# Altium schematic sheet ADS8686S_BLOCK_A.SchDoc
size A3; SheetNumber: 12; SheetTotal: 14
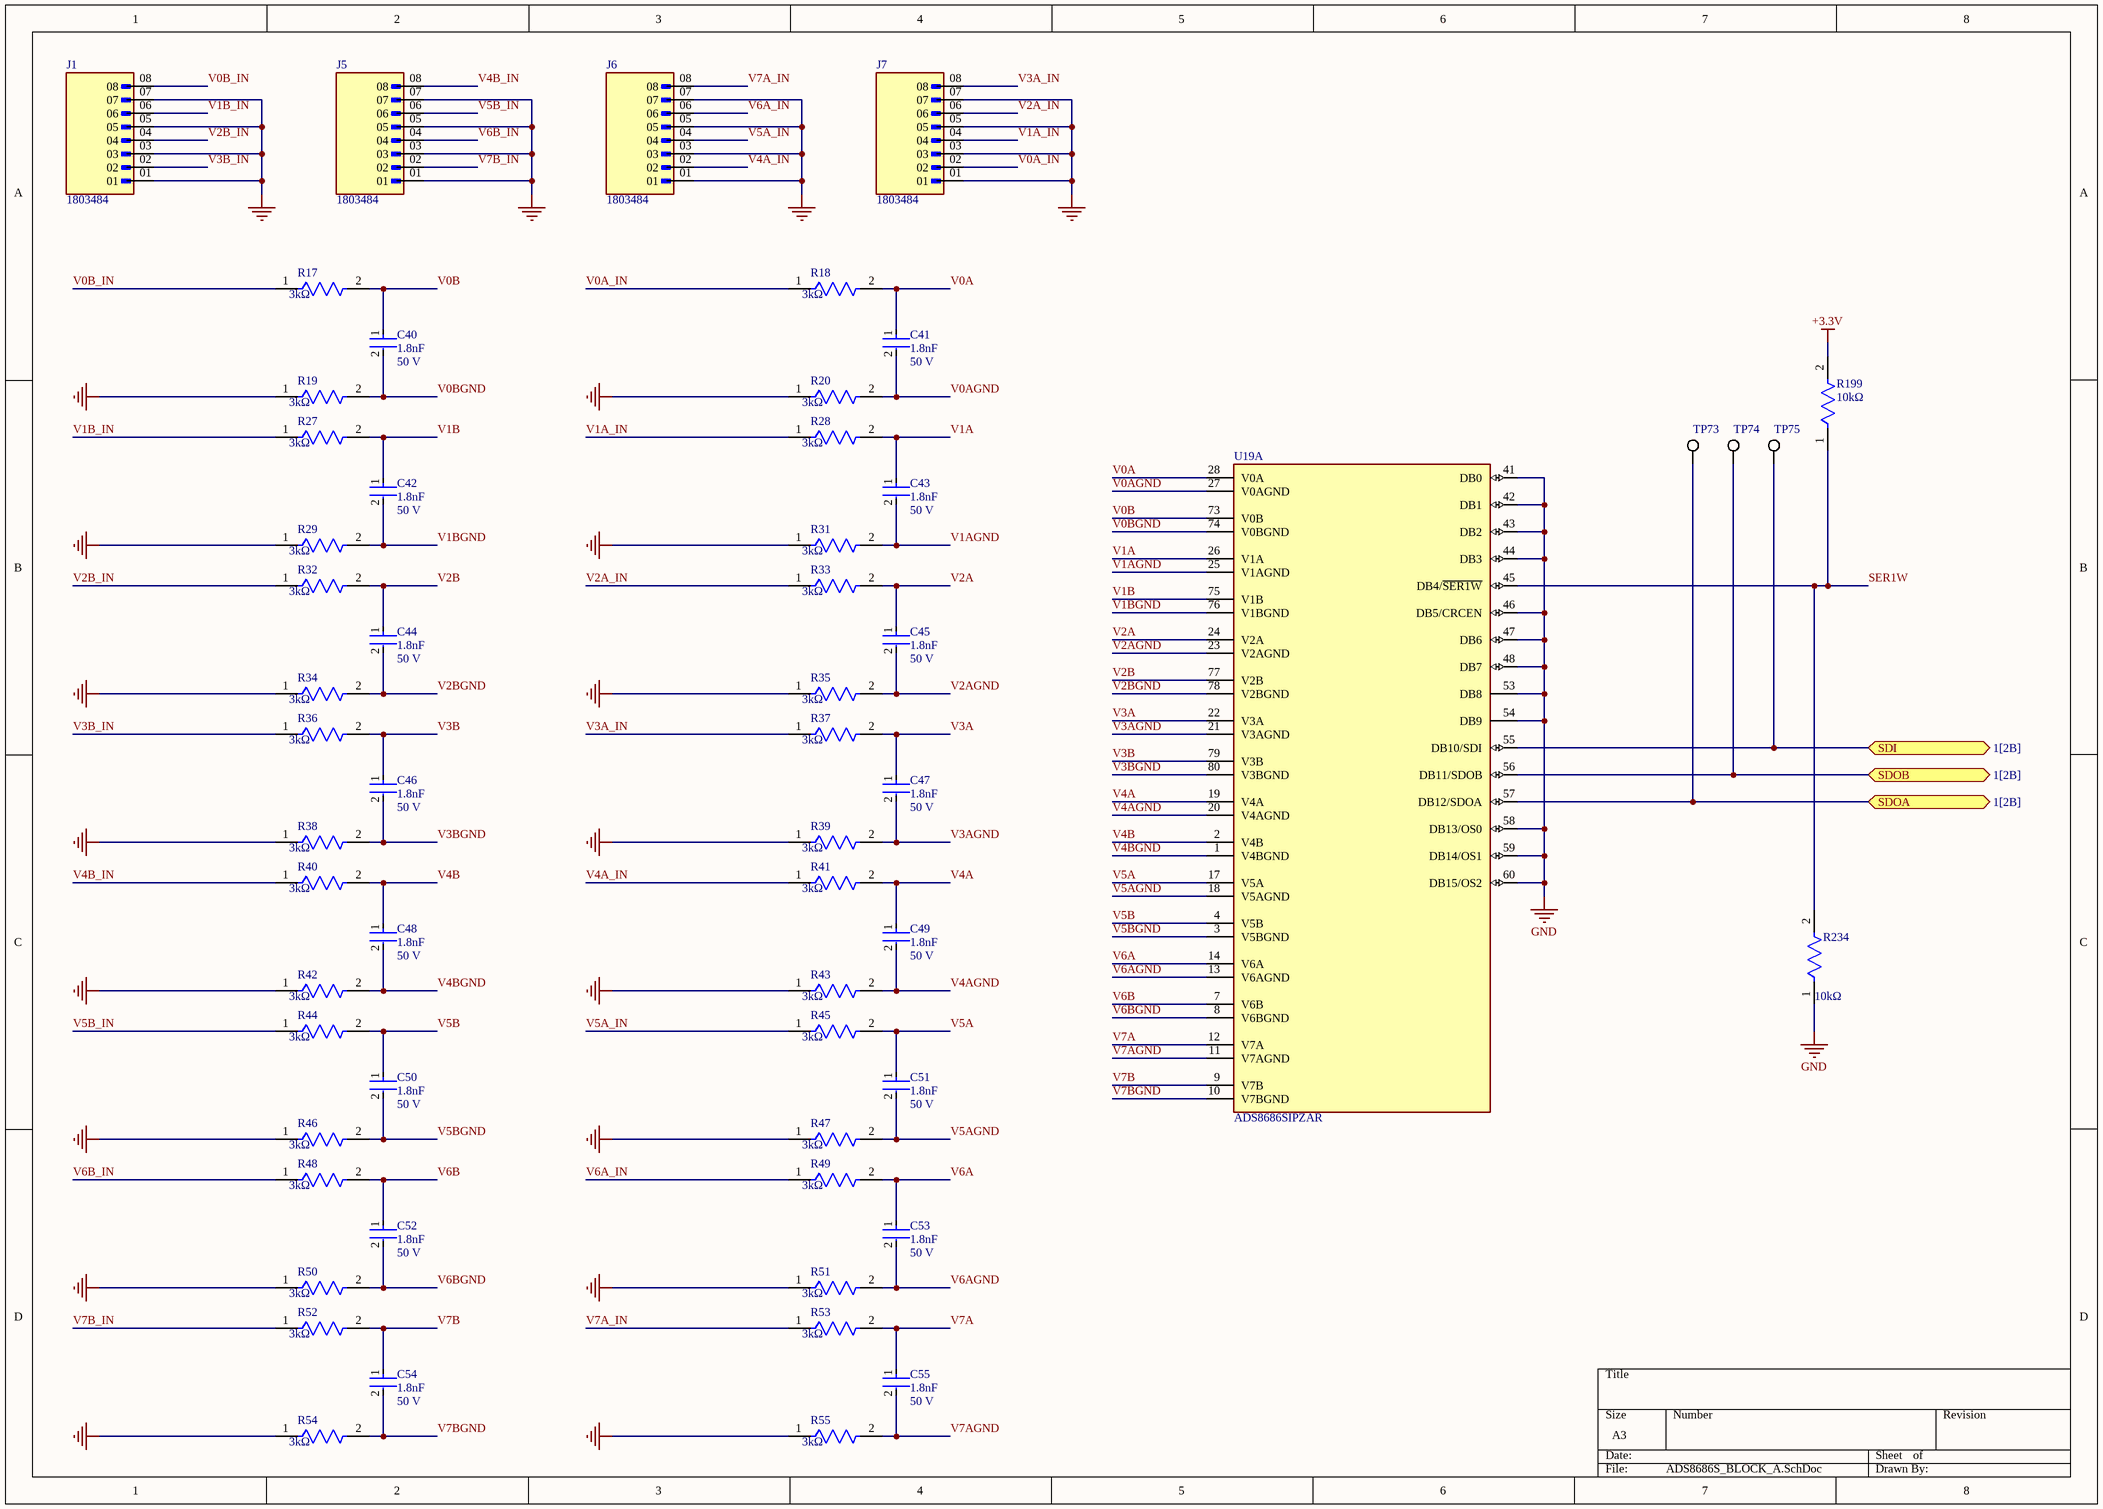
[diagram p0: ADS8686S_BLOCK_A.SchDoc]

## Parts
C40  Capacitance: 1.8nF  Voltage Rating: 50 V  [FP-C0603C-CF-IPC_B]  (hidden comment: C0603C182J5GACTU)
C41  Capacitance: 1.8nF  Voltage Rating: 50 V  [FP-C0603C-CF-IPC_B]  (hidden comment: C0603C182J5GACTU)
C42  Capacitance: 1.8nF  Voltage Rating: 50 V  [FP-C0603C-CF-IPC_B]  (hidden comment: C0603C182J5GACTU)
C43  Capacitance: 1.8nF  Voltage Rating: 50 V  [FP-C0603C-CF-IPC_B]  (hidden comment: C0603C182J5GACTU)
C44  Capacitance: 1.8nF  Voltage Rating: 50 V  [FP-C0603C-CF-IPC_B]  (hidden comment: C0603C182J5GACTU)
C45  Capacitance: 1.8nF  Voltage Rating: 50 V  [FP-C0603C-CF-IPC_B]  (hidden comment: C0603C182J5GACTU)
C46  Capacitance: 1.8nF  Voltage Rating: 50 V  [FP-C0603C-CF-IPC_B]  (hidden comment: C0603C182J5GACTU)
C47  Capacitance: 1.8nF  Voltage Rating: 50 V  [FP-C0603C-CF-IPC_B]  (hidden comment: C0603C182J5GACTU)
C48  Capacitance: 1.8nF  Voltage Rating: 50 V  [FP-C0603C-CF-IPC_B]  (hidden comment: C0603C182J5GACTU)
C49  Capacitance: 1.8nF  Voltage Rating: 50 V  [FP-C0603C-CF-IPC_B]  (hidden comment: C0603C182J5GACTU)
C50  Capacitance: 1.8nF  Voltage Rating: 50 V  [FP-C0603C-CF-IPC_B]  (hidden comment: C0603C182J5GACTU)
C51  Capacitance: 1.8nF  Voltage Rating: 50 V  [FP-C0603C-CF-IPC_B]  (hidden comment: C0603C182J5GACTU)
C52  Capacitance: 1.8nF  Voltage Rating: 50 V  [FP-C0603C-CF-IPC_B]  (hidden comment: C0603C182J5GACTU)
C53  Capacitance: 1.8nF  Voltage Rating: 50 V  [FP-C0603C-CF-IPC_B]  (hidden comment: C0603C182J5GACTU)
C54  Capacitance: 1.8nF  Voltage Rating: 50 V  [FP-C0603C-CF-IPC_B]  (hidden comment: C0603C182J5GACTU)
C55  Capacitance: 1.8nF  Voltage Rating: 50 V  [FP-C0603C-CF-IPC_B]  (hidden comment: C0603C182J5GACTU)
J1  1803484  [PHOENIX_1803484]
J5  1803484  [PHOENIX_1803484]
J6  1803484  [PHOENIX_1803484]
J7  1803484  [PHOENIX_1803484]
R17  Resistance: 3kΩ  [FP-AC0603-IPC_B]  (hidden comment: AC0603FR-073KL)
R18  Resistance: 3kΩ  [FP-AC0603-IPC_B]  (hidden comment: AC0603FR-073KL)
R19  Resistance: 3kΩ  [FP-AC0603-IPC_B]  (hidden comment: AC0603FR-073KL)
R20  Resistance: 3kΩ  [FP-AC0603-IPC_B]  (hidden comment: AC0603FR-073KL)
R27  Resistance: 3kΩ  [FP-AC0603-IPC_B]  (hidden comment: AC0603FR-073KL)
R28  Resistance: 3kΩ  [FP-AC0603-IPC_B]  (hidden comment: AC0603FR-073KL)
R29  Resistance: 3kΩ  [FP-AC0603-IPC_B]  (hidden comment: AC0603FR-073KL)
R31  Resistance: 3kΩ  [FP-AC0603-IPC_B]  (hidden comment: AC0603FR-073KL)
R32  Resistance: 3kΩ  [FP-AC0603-IPC_B]  (hidden comment: AC0603FR-073KL)
R33  Resistance: 3kΩ  [FP-AC0603-IPC_B]  (hidden comment: AC0603FR-073KL)
R34  Resistance: 3kΩ  [FP-AC0603-IPC_B]  (hidden comment: AC0603FR-073KL)
R35  Resistance: 3kΩ  [FP-AC0603-IPC_B]  (hidden comment: AC0603FR-073KL)
R36  Resistance: 3kΩ  [FP-AC0603-IPC_B]  (hidden comment: AC0603FR-073KL)
R37  Resistance: 3kΩ  [FP-AC0603-IPC_B]  (hidden comment: AC0603FR-073KL)
R38  Resistance: 3kΩ  [FP-AC0603-IPC_B]  (hidden comment: AC0603FR-073KL)
R39  Resistance: 3kΩ  [FP-AC0603-IPC_B]  (hidden comment: AC0603FR-073KL)
R40  Resistance: 3kΩ  [FP-AC0603-IPC_B]  (hidden comment: AC0603FR-073KL)
R41  Resistance: 3kΩ  [FP-AC0603-IPC_B]  (hidden comment: AC0603FR-073KL)
R42  Resistance: 3kΩ  [FP-AC0603-IPC_B]  (hidden comment: AC0603FR-073KL)
R43  Resistance: 3kΩ  [FP-AC0603-IPC_B]  (hidden comment: AC0603FR-073KL)
R44  Resistance: 3kΩ  [FP-AC0603-IPC_B]  (hidden comment: AC0603FR-073KL)
R45  Resistance: 3kΩ  [FP-AC0603-IPC_B]  (hidden comment: AC0603FR-073KL)
R46  Resistance: 3kΩ  [FP-AC0603-IPC_B]  (hidden comment: AC0603FR-073KL)
R47  Resistance: 3kΩ  [FP-AC0603-IPC_B]  (hidden comment: AC0603FR-073KL)
R48  Resistance: 3kΩ  [FP-AC0603-IPC_B]  (hidden comment: AC0603FR-073KL)
R49  Resistance: 3kΩ  [FP-AC0603-IPC_B]  (hidden comment: AC0603FR-073KL)
R50  Resistance: 3kΩ  [FP-AC0603-IPC_B]  (hidden comment: AC0603FR-073KL)
R51  Resistance: 3kΩ  [FP-AC0603-IPC_B]  (hidden comment: AC0603FR-073KL)
R52  Resistance: 3kΩ  [FP-AC0603-IPC_B]  (hidden comment: AC0603FR-073KL)
R53  Resistance: 3kΩ  [FP-AC0603-IPC_B]  (hidden comment: AC0603FR-073KL)
R54  Resistance: 3kΩ  [FP-AC0603-IPC_B]  (hidden comment: AC0603FR-073KL)
R55  Resistance: 3kΩ  [FP-AC0603-IPC_B]  (hidden comment: AC0603FR-073KL)
R199  Resistance: 10kΩ  [FP-RC0603-0_55-IPC_B]  (hidden comment: RC0603FR-0710KL)
R234  Resistance: 10kΩ  [FP-RC0603-0_55-IPC_B]  (hidden comment: RC0603FR-0710KL)
TP73  5019  [KSTN-5019_V]  (value not drawn)
TP74  5019  [KSTN-5019_V]  (value not drawn)
TP75  5019  [KSTN-5019_V]  (value not drawn)
U19  ADS8686SIPZAR  [TI-RECOMMENDED]  (part A of 2)

## Ports
SDI (bidir, see 1[2B]), SDOA (bidir, see 1[2B]), SDOB (bidir, see 1[2B])

## Nets
+3.3V: R199.2
GND: J1.01 J1.03 J1.05 J1.07 J5.01 J5.03 J5.05 J5.07 J6.01 J6.03 J6.05 J6.07 J7.01 J7.03 J7.05 J7.07 R19.1 R20.1 R29.1 R31.1 R34.1 R35.1 R38.1 R39.1 R42.1 R43.1 R46.1 R47.1 R50.1 R51.1 R54.1 R55.1 R234.1 U19.41(DB0) U19.42(DB1) U19.43(DB2) U19.44(DB3) U19.46(DB5/CRCEN) U19.47(DB6) U19.48(DB7) U19.53(DB8) U19.54(DB9) U19.58(DB13/OS0) U19.59(DB14/OS1) U19.60(DB15/OS2)
SDI: TP75.1 U19.55(DB10/SDI) ; port SDI
SDOA: TP73.1 U19.57(DB12/SDOA) ; port SDOA
SDOB: TP74.1 U19.56(DB11/SDOB) ; port SDOB
SER1W: R199.1 R234.2 U19.45(DB4/~{SER1W})
V0A: C41.1 R18.2 U19.28(V0A)
V0A_IN: J7.02 R18.1
V0AGND: C41.2 R20.2 U19.27(V0AGND)
V0B: C40.1 R17.2 U19.73(V0B)
V0B_IN: J1.08 R17.1
V0BGND: C40.2 R19.2 U19.74(V0BGND)
V1A: C43.1 R28.2 U19.26(V1A)
V1A_IN: J7.04 R28.1
V1AGND: C43.2 R31.2 U19.25(V1AGND)
V1B: C42.1 R27.2 U19.75(V1B)
V1B_IN: J1.06 R27.1
V1BGND: C42.2 R29.2 U19.76(V1BGND)
V2A: C45.1 R33.2 U19.24(V2A)
V2A_IN: J7.06 R33.1
V2AGND: C45.2 R35.2 U19.23(V2AGND)
V2B: C44.1 R32.2 U19.77(V2B)
V2B_IN: J1.04 R32.1
V2BGND: C44.2 R34.2 U19.78(V2BGND)
V3A: C47.1 R37.2 U19.22(V3A)
V3A_IN: J7.08 R37.1
V3AGND: C47.2 R39.2 U19.21(V3AGND)
V3B: C46.1 R36.2 U19.79(V3B)
V3B_IN: J1.02 R36.1
V3BGND: C46.2 R38.2 U19.80(V3BGND)
V4A: C49.1 R41.2 U19.19(V4A)
V4A_IN: J6.02 R41.1
V4AGND: C49.2 R43.2 U19.20(V4AGND)
V4B: C48.1 R40.2 U19.2(V4B)
V4B_IN: J5.08 R40.1
V4BGND: C48.2 R42.2 U19.1(V4BGND)
V5A: C51.1 R45.2 U19.17(V5A)
V5A_IN: J6.04 R45.1
V5AGND: C51.2 R47.2 U19.18(V5AGND)
V5B: C50.1 R44.2 U19.4(V5B)
V5B_IN: J5.06 R44.1
V5BGND: C50.2 R46.2 U19.3(V5BGND)
V6A: C53.1 R49.2 U19.14(V6A)
V6A_IN: J6.06 R49.1
V6AGND: C53.2 R51.2 U19.13(V6AGND)
V6B: C52.1 R48.2 U19.7(V6B)
V6B_IN: J5.04 R48.1
V6BGND: C52.2 R50.2 U19.8(V6BGND)
V7A: C55.1 R53.2 U19.12(V7A)
V7A_IN: J6.08 R53.1
V7AGND: C55.2 R55.2 U19.11(V7AGND)
V7B: C54.1 R52.2 U19.9(V7B)
V7B_IN: J5.02 R52.1
V7BGND: C54.2 R54.2 U19.10(V7BGND)

## Library data of the parts
C40-C55 = CMP-2006-03369-2: CAP CER 1800PF 50V NP0 0603; Manufacturer: KEMET; Value: 1,800 pF; Temperature Characteristic: C0G; Tolerance: 0.05; Material: Ceramic; Automotive Grade: Grade 1; Temperature Coefficient: 30ppm/°C; Package: C0603C-CF; Temperature Range High: +125°C; Temperature Range Low: -55°C; Category: Cap; Automotive: Yes; Manufacturer Part Number: C0603C182J5GACTU; RoHS: TRUE; Device Class L2: Capacitors; Device Class L3: Ceramic Capacitors; Octopart: https://octopart.com/c0603c182j5gactu-kemet-13174208; Lead Free: Yes; Temperature: -55°C to +125°C; Height: 0.87mm; Mouser Description: Multilayer Ceramic Capacitors MLCC - SMD/SMT 50volts 1800pF 5% C0G; Digikey Description: CAP CER 1800PF 50V NP0 0603; Device Class L1: Passive Components; ComponentLink2URL: https://api.kemet.com/component-edge/download/datasheet/C0603C100J5GACAUTO.pdf; ComponentLink2Description: Datasheet
J1 J5-J7 = 1803484: MF: {'manufacturer': u'Phoenix Contact'}; Package: None; Price: None; Value: *; MP: 1803484; Availability: Unavailable
R17-R20 R27-R29 R31-R55 = CMP-2000-04842-2: RES 3kΩ 1.00% 0.1W 0603; Max Power Dissipation: 100mW; Temperature Coefficient: 100ppm/°C; Tolerance: 1%; Voltage Rating: 50V; Series: AC; Lead Free: Lead Free; Height: 0.45mm; Case Code (Metric): 1608; Case Code (Imperial): 0603; Case/Package: 0603; Length: 1.6mm; RoHS Compliant: Yes; Width: 0.8mm; Ratings: AEC-Q200; Packaging: Tape and Reel; Termination: SMD/SMT; Max Operating Temperature: 155°C; Resistor Type: Thick Film; Power Rating: 100mW; Min Operating Temperature: -55°C; Number of Terminations: 2; Features: Moisture Resistant
R199 R234 = CMP-2100-03664-2: RES 10K OHM 1% 1/10W 0603; Voltage Rating: 75V; Voltage Rating (DC): 50V; Power Rating: 100mW; Temperature Coefficient: 100ppm/°C; Depth: 0.8mm; Termination: SMD/SMT; Resistor Type: Thick Film; Series: RC; Construction: Rectangular; Features: Moisture Resistant; Packaging: Tape and Reel; Min Operating Temperature: -55°C; Number of Terminations: 2; Lead Pitch: 0.3mm; RoHS Compliant: Yes; Case/Package: 0603; Resistance Tolerance: 1%; Military Standard: Not; Weight: 7.1E-05oz; Number of Pins: 2; Tolerance: 1%; Length: 1.6mm; Case Code (Imperial): 0603; Lead Free: Lead Free; Width: 0.8mm; Max Power Dissipation: 100mW; Height: 0.45mm; Max Operating Temperature: 155°C; Case Code (Metric): 1608; Size Code: 0603
TP73-TP75 = CMP-1672-00008-1: Test Point, 1 Position SMD, RoHS, Tape and Reel; ComponentLink1Description: Manufacturer URL; Package Quantity: 1000; DatasheetVersion: 03/2014; Packaging: Tape and Reel; ComponentLink2URL: http://www.keyelco.com/product-pdf.cfm?p=1357; ComponentLink1URL: http://www.keyelco.com/; Mount: Surface Mount; Contact Plating: Silver; PackageDescription: 1-Pin Surface Mount Device, Body 3.81 x 2.03 mm; Pins: 1; RoHSCompliant: True; Mounting Technology: Surface Mount; ComponentLink2Description: Datasheet; PackageReference: 5019
U19 = ADS8686SIPZAR: 16-channel 16-bit 1-MSPS dual simultaneous-sampling ADC with integrated analog front end (AFE) 80-LQFP -40 to 125; Manufacturer: Texas Instruments; Supplier: Mouser; Supplier Part Number: 595-ADS8686SIPZAR; Manufacturer Part Number: ADS8686SIPZAR; RoHS: Yes; Category: Analog to Digital Converters (ADCs); Stock: 975; Pricing: 1=20.61, 10=19.01, 50=18.16, 100=16.24, 1000=13.88, 10000=13.88 (USD); RoHS Compliant: Yes; Supplier 1: Mouser; Supplier Part Number 1: 595-ADS8686SIPZAR